# Altium schematic sheet Main.SchDoc
size A4
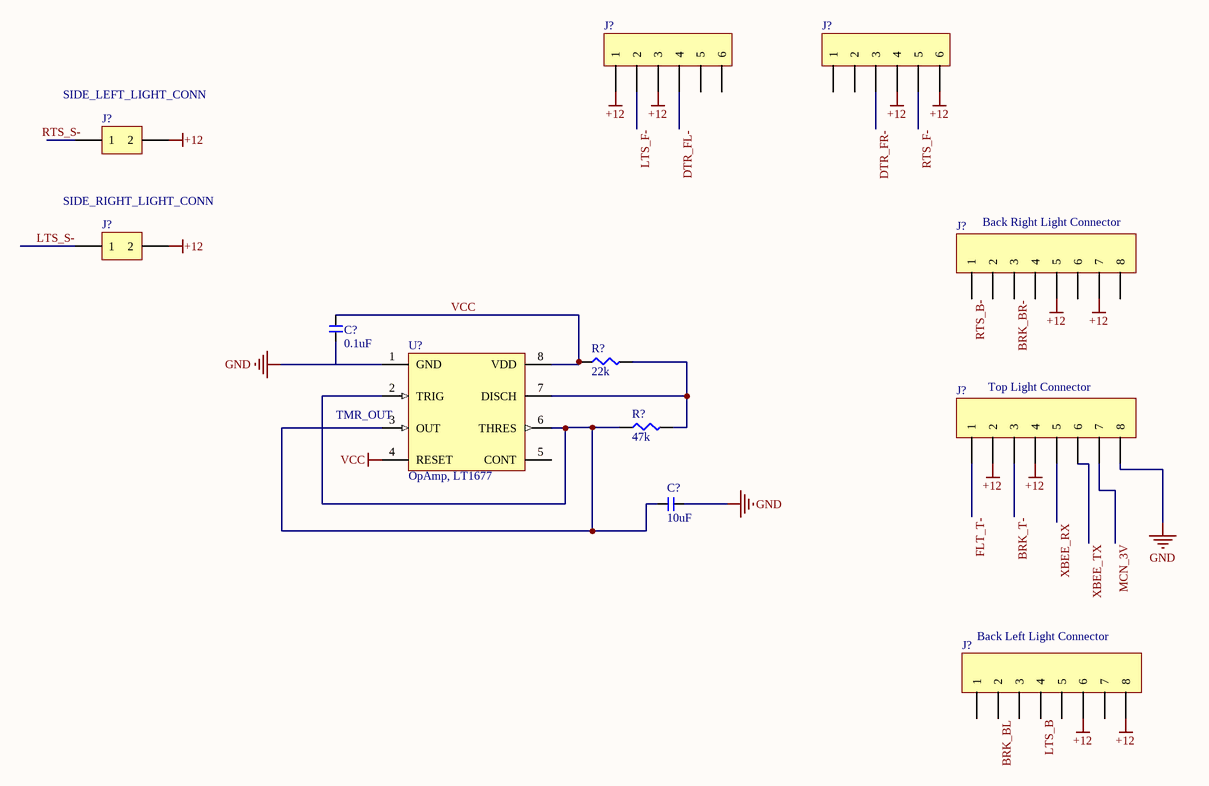
[diagram p0: Main.SchDoc]

## Parts
(Parts that share a designator on the sheet are numbered #1, #2 ... from top to bottom, then left to right.)
C?#1  0.1uF  [C0805]
C?#2  10uF  [C0805]
J?#1  2x3 Socket, RA  [MOLEX 105314 6 CON]  (value not drawn)
J?#2  2x3 Socket, RA  [MOLEX 105314 6 CON]  (value not drawn)
J?#3  1x2 HDR100  [Molex 0901200762]  (value not drawn)
J?#4  1x2 HDR100  [Molex 0901200762]  (value not drawn)
J?#5  2x4 Socket, RA  [Molex 105314 8 CON]  (value not drawn)
J?#6  2x4 Socket, RA  [Molex 105314 8 CON]  (value not drawn)
J?#7  (no value)  [Molex 105314 8 CON]
R?#1  22k  [R0805]
R?#2  47k
U?  OpAmp, LT1677  [LT1677IS8#TRPBF]

## Nets
+12: J?#1.1 J?#1.3 J?#2.4 J?#2.6 J?#3.2 J?#4.2 J?#5.5 J?#5.7 J?#6.2 J?#6.4 J?#7.6 J?#7.8
GND: C?#1.1 C?#2.2 J?#6.8 U?.1(GND)
VCC: C?#1.2 R?#1.1 U?.4(RESET) U?.8(VDD)
BRK_BL: J?#7.2
BRK_BR-: J?#5.3
BRK_T-: J?#6.3
DTR_FL-: J?#1.4
DTR_FR-: J?#2.3
FLT_T-: J?#6.1
LTS_B: J?#7.4
LTS_F-: J?#1.2
LTS_S-: J?#4.1
MCN_3V: J?#6.7
RTS_B-: J?#5.1
RTS_F-: J?#2.5
XBEE_RX: J?#6.5
XBEE_TX: J?#6.6
NetC?#2_1: C?#2.1 R?#2.1 U?.2(TRIG) U?.3(OUT) U?.6(THRES)
NetR?#1_2: R?#1.2 R?#2.2 U?.7(DISCH)

Not connected (* = marked no-connect by the designer): J?#1 5 6; J?#2 1 2; J?#3 1; J?#5 2 4 6 8; J?#7 1 3 5 7; U? 5(CONT)

## Notes on the sheet
- (near J?#3) SIDE_LEFT_LIGHT_CONN
- (near J?#4) SIDE_RIGHT_LIGHT_CONN
- (near J?#5) Back Right Light Connector
- (near U?) TMR_OUT
- (near J?#6) Top Light Connector
- (near J?#7) Back Left Light Connector
- Labels drawn without touching a wire or pin: RTS_S-

## Library data of the parts
C?#1 = CL21B104KBCWPNC: CAP CER 0.1UF 50V X7R 0805; Manufacturer: Samsung; Capacitance: 100nF; Tolerance: 10%; Supplier 1: Digi-Key; Supplier Part Number 1: 1276-6557-1-ND; Manufacturer Part Number: CL21B104KBCWPNC; Stock 1: 6545; Pricing 1: 1 = 0.10000, 10 = 0.06700, 100 = 0.02990, 500 = 0.02138, 1000 = 0.01680 (USD); RoHS: Yes; Mount: Surface Mount; Case/Package: 0805; Case Code (Metric): 2012; Case Code (Imperial): 0805; Min Operating Temperature: -55°C; Max Operating Temperature: 125°C; Packaging: Tape and Reel; Voltage Rating: 50V; Features: Soft Termination; Length: 0.079inch; Width: 0.049inch; Thickness: 0.053inch; Ratings: AEC-Q200; Category: Capacitors
C?#2 = C0805C106K8PACTU: CAP CER 10UF 10V X5R 0805; Manufacturer: Samsung; Manufacturer Part Number: CL21B105KAFNNNE; Capacitance: 1uF; Tolerance: 10%; Voltage Rating: 25V; Dielectric: X7R; RoHS: Yes; Mount: Surface Mount; Case/Package: 0805; Contact Plating: Tin; Case Code (Metric): 2012; Case Code (Imperial): 0805; Min Operating Temperature: -55°C; Max Operating Temperature: 125°C; Packaging: Tape and Reel; Package Quantity: 1; Voltage: 25V; Voltage Rating (DC): 25V; Length: 2mm; Height: 1.25mm; Depth: 1.25mm; Width: 0.049inch; Thickness: 0.053inch; Radiation Hardening: No; Lead Free: Lead Free; Category: Capacitors; ComponentLink1Description: https://www.digikey.ca/product-detail/en/kemet/C0805C106K8PACTU/399-4925-1-ND/1090920; ComponentLink1URL: https://www.digikey.ca/product-detail/en/kemet/C0805C106K8PACTU/399-4925-1-ND/1090920; Supplier 1: Digi-Key; Supplier Part Number 1: 399-4925-1-ND
J?#1 J?#2 = 1053141206: CONN HEADER R/A 6POS 2.5MM; Manufacturer: Molex; Gender: Male; Supplier 1: Digi-Key; Supplier Part Number 1: WM14977-ND; Manufacturer Part Number: 1053141206; Stock 1: 3725; Pricing 1: 1 = 1.86000, 10 = 1.68400, 204 = 1.44314, 612 = 1.20260, 1020 = 1.03080, 5100 = 0.91398, 10200 = 0.89336 (USD); RoHS: No; Mount: Through Hole; Contact Plating: Gold; Contact Material: Brass; Color: Black; Termination: Through Hole; Number of Rows: 2; REACH SVHC: Unknown; ComponentLink1URL: http://www.farnell.com/datasheets/2221464.pdf?src-supplier=Farnell; ComponentLink1Description: http://www.farnell.com/datasheets/2221464.pdf?src-supplier=Farnell; ComponentLink2URL: http://www.farnell.com/datasheets/2059602.pdf?src-supplier=Element14; ComponentLink2Description: http://www.farnell.com/datasheets/2059602.pdf?src-supplier=Element14; ComponentLink3URL: https://www.molex.com/pdm_docs/ps/PS-105300-100-001.pdf?src-supplier=Digi-Key; ComponentLink3Description: https://www.molex.com/pdm_docs/ps/PS-105300-100-001.pdf?src-supplier=Digi-Key; Category: Connectors
J?#3 J?#4 = 0901200762: CONN HEADER VERT 2POS 2.54MM; Manufacturer: Molex; Number of Positions: 2; Connector Type: Male Pin; Contact Resistance: 20mR; Max Voltage Rating (DC): 350V; Gender: Male; Supplier 1: Digi-Key; Supplier Part Number 1: WM8084-ND; Manufacturer Part Number: 0901200762; Stock 1: 37733; Pricing 1: 1 = 0.560000, 10 = 0.530000, 100 = 0.406000, 500 = 0.353000, 1000 = 0.291230, 5000 = 0.255930, 10000 = 0.238280 (USD); RoHS: Yes; Mount: Through Hole; Color: Black; Housing Color: Black; Housing Material: Polyester; Contact Plating: Gold; Contact Material: Brass; Min Operating Temperature: -55°C; Max Operating Temperature: 125°C; Packaging: Bulk; Number of Rows: 1; Termination: Solder; Number of Contacts: 2; Orientation: Straight; Max Voltage Rating (AC): 350V; Length: 5.08mm; Pitch: 2.54mm; Depth: 2.54mm; Contact Mating Length: 0.266inch; ComponentLink1URL: https://datasheet.ciiva.com/711/901200762-sd-711939.pdf?src-supplier=Digi-Key; ComponentLink1Description: https://datasheet.ciiva.com/711/901200762-sd-711939.pdf?src-supplier=Digi-Key; ComponentLink2URL: https://datasheet.ciiva.com/3117/0901200762-pcb-headers-3117809.pdf?src-supplier=Avnet; ComponentLink2Description: https://datasheet.ciiva.com/3117/0901200762-pcb-headers-3117809.pdf?src-supplier=Avnet; Category: Connectors
J?#5-J?#7 = 1053141208: CONN HEADER R/A 8POS 2.5MM; Manufacturer: Molex; Gender: Male; Supplier 1: Digi-Key; Supplier Part Number 1: WM14978-ND; Manufacturer Part Number: 1053141208; Stock 1: 3073; Pricing 1: 1 = 2.35000, 10 = 2.13500, 156 = 1.82994, 624 = 1.52495, 1092 = 1.30710, 5148 = 1.15896 (USD); RoHS: No; Mount: Through Hole; Contact Plating: Gold; Contact Material: Brass; Color: Black; Termination: Through Hole; Number of Rows: 2; REACH SVHC: Unknown; ComponentLink1URL: https://www.molex.com/pdm_docs/ps/PS-105300-100-001.pdf?src-supplier=Digi-Key; ComponentLink1Description: https://www.molex.com/pdm_docs/ps/PS-105300-100-001.pdf?src-supplier=Digi-Key; ComponentLink2URL: http://www.farnell.com/datasheets/2059602.pdf?src-supplier=Element14; ComponentLink2Description: http://www.farnell.com/datasheets/2059602.pdf?src-supplier=Element14; Category: Connectors
R?#1 = ERJ6ENF22000
R?#2 = ERJ6ENF47000V
U? = LT1677IS8#TRPBF: IC OPAMP GP 7.2MHZ RRO 8SO; Manufacturer: Analog Devices / Linear Technology; Common Mode Rejection Ratio: 60dB; Min Dual Supply Voltage: 1.5V; Max Dual Supply Voltage: 18V; Slew Rate: 2.5V/µs; Max Supply Voltage: 44V; Min Supply Voltage: 2.5V; Number of Circuits: 1; Input Bias Current: 2nA; Input Offset Voltage (Vos): 60uV; Operating Supply Current: 2.75mA; Output Current per Channel: 35mA; Voltage Gain: 133.98dB; Power Supply Rejection Ratio (PSRR): 108dB; Supplier 1: Digi-Key; Supplier Part Number 1: LT1677IS8#TRPBFCT-ND; Manufacturer Part Number: LT1677IS8#TRPBF; Stock 1: 4539; Pricing 1: 1 = 5.74000, 25 = 5.12560 (USD); RoHS: Yes; Case/Package: SOIC; Number of Pins: 8; Min Operating Temperature: -40°C; Max Operating Temperature: 85°C; Package Quantity: 2500; Unity Gain Bandwidth Product: 7.2MHz; Nominal Gain Bandwidth Product: 7.2MHz; Packaging: Tape and Reel; Gain Bandwidth Product: 7.2MHz; Number of Elements: 1; Number of Channels: 1; Lead Free: Lead Free; ComponentLink1URL: http://www.linear.com/docs/2102?src-supplier=Digi-Key; ComponentLink1Description: http://www.linear.com/docs/2102?src-supplier=Digi-Key; ComponentLink2URL: http://datasheet.iiic.cc/linear_technology/LT1677IS8_TRPBF.pdf?src-supplier=IIIC; ComponentLink2Description: http://datasheet.iiic.cc/linear_technology/LT1677IS8_TRPBF.pdf?src-supplier=IIIC; Category: Integrated Circuits (ICs)